# Altium schematic sheet iMX 8M PLUS.SchDoc: i.MX 8M - BLOCK DIAGRAM
size A3; DrawnBy: ELIO F.; Engineer: ELIO F.; Revision: A; SheetNumber: 3; SheetTotal: 16
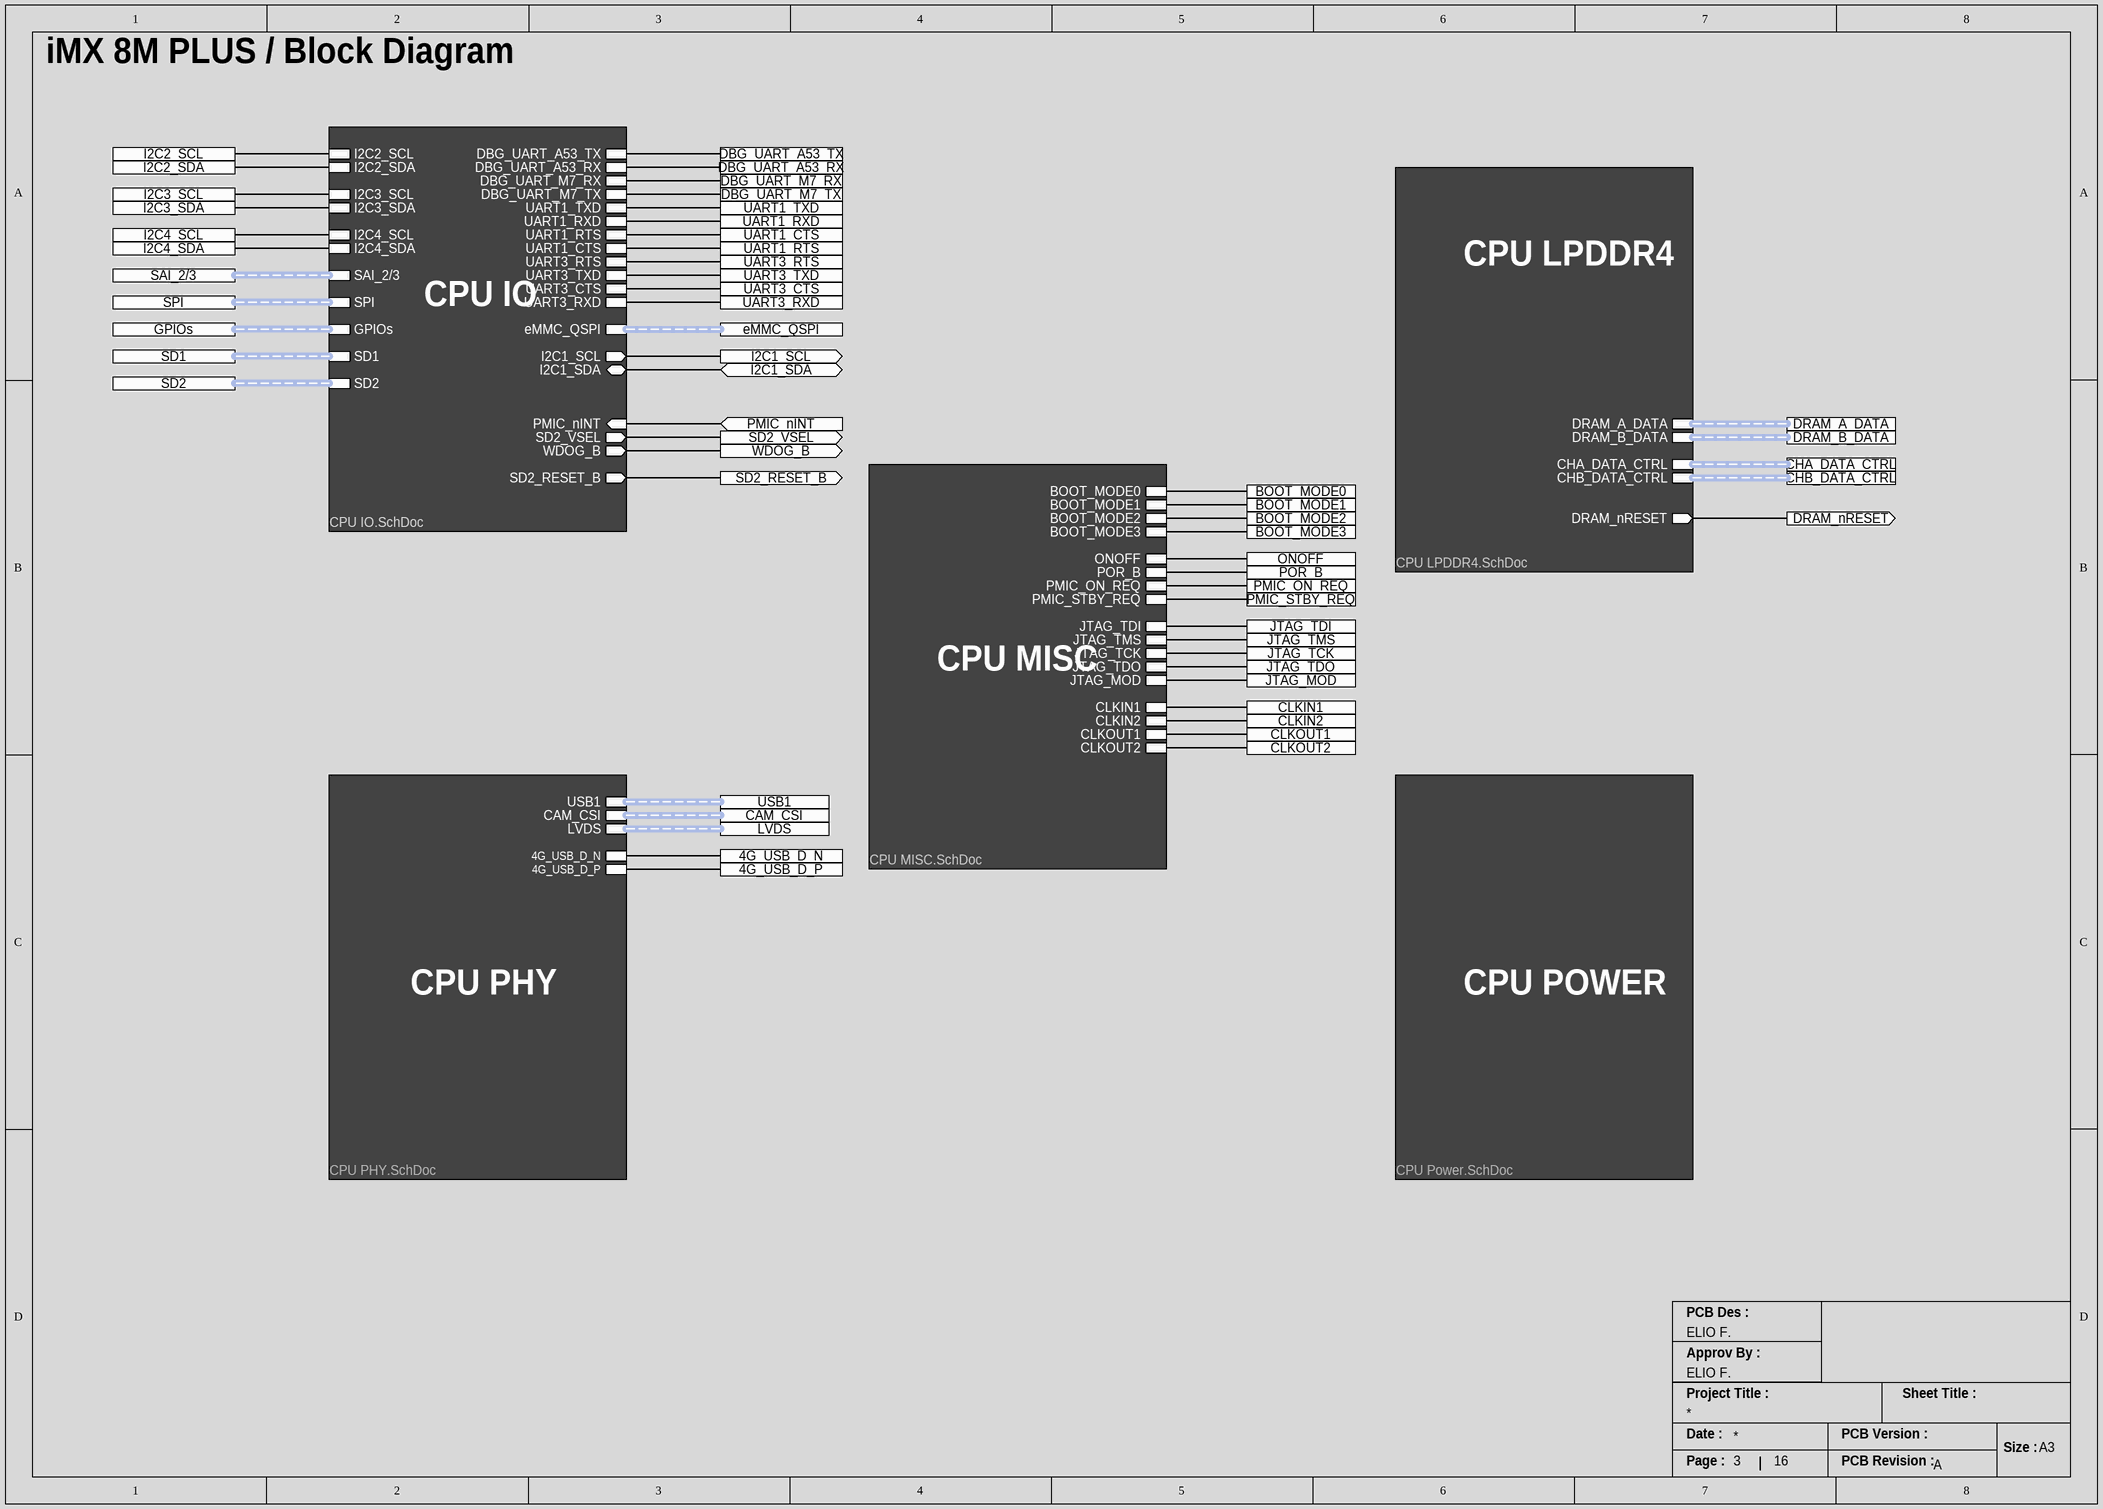
[diagram p0: iMX 8M PLUS.SchDoc]

## Sub-sheets
H = CPU IO.SchDoc: DBG_UART_A53_TX, DBG_UART_A53_RX, DBG_UART_M7_RX, DBG_UART_M7_TX, eMMC_QSPI (harness NAND), I2C1_SCL (out), I2C1_SDA (bidir), PMIC_nINT (in), SD2_VSEL (out), WDOG_B (out), SD2_RESET_B (out), UART1_TXD, UART1_RXD, UART1_RTS, UART1_CTS, I2C2_SCL, I2C2_SDA, I2C3_SCL, I2C3_SDA, I2C4_SCL, I2C4_SDA, UART3_RTS, UART3_TXD, UART3_CTS, UART3_RXD, GPIOs (harness GPIOs), SPI (harness SPI), SAI_2/3 (harness SAI2), SD1 (harness SD1), SD2 (harness SD2)
I = CPU LPDDR4.SchDoc: DRAM_nRESET (out), DRAM_A_DATA (harness DRAM_A_DATA), CHA_DATA_CTRL (harness CHA_DATA_CTRL), DRAM_B_DATA (harness DRAM_B_DATA), CHB_DATA_CTRL (harness CHB_DATA_CTRL)
J = CPU MISC.SchDoc: BOOT_MODE0, BOOT_MODE1, ONOFF, POR_B, PMIC_ON_REQ, PMIC_STBY_REQ, CLKIN1, CLKIN2, CLKOUT1, CLKOUT2, BOOT_MODE2, BOOT_MODE3, JTAG_TDI, JTAG_TMS, JTAG_TCK, JTAG_TDO, JTAG_MOD
K = CPU PHY.SchDoc: USB1 (harness USB), CAM_CSI (harness CAM_CSI), LVDS (harness LVDS), 4G_USB_D_N, 4G_USB_D_P
L = CPU Power.SchDoc: no entries

## Ports
4G_USB_D_N, 4G_USB_D_P, BOOT_MODE0, BOOT_MODE1, BOOT_MODE2, BOOT_MODE3, CAM_CSI (harness DRAM_A), CHA_DATA_CTRL (harness DRAM_A), CHB_DATA_CTRL (harness DRAM_A), CLKIN1, CLKIN2, CLKOUT1, CLKOUT2, DBG_UART_A53_RX, DBG_UART_A53_TX, DBG_UART_M7_RX, DBG_UART_M7_TX, DRAM_A_DATA (harness DRAM_A), DRAM_B_DATA (harness DRAM_A), DRAM_nRESET (out), eMMC_QSPI (harness DRAM_A), GPIOs (harness DRAM_A), I2C1_SCL (out), I2C1_SDA (bidir), I2C2_SCL, I2C2_SDA, I2C3_SCL, I2C3_SDA, I2C4_SCL, I2C4_SDA, JTAG_MOD, JTAG_TCK, JTAG_TDI, JTAG_TDO, JTAG_TMS, LVDS (harness DRAM_A), ONOFF, PMIC_nINT (in), PMIC_ON_REQ, PMIC_STBY_REQ, POR_B, SAI_2/3 (harness DRAM_A), SD1 (harness DRAM_A), SD2 (harness DRAM_A), SD2_RESET_B (out), SD2_VSEL (out), SPI (harness DRAM_A), UART1_CTS, UART1_RTS, UART1_RXD, UART1_TXD, UART3_CTS, UART3_RTS, UART3_RXD, UART3_TXD, USB1 (harness DRAM_A), WDOG_B (out)

## Nets
4G_USB_D_N: port 4G_USB_D_N, sheet K/4G_USB_D_N
4G_USB_D_P: port 4G_USB_D_P, sheet K/4G_USB_D_P
BOOT_MODE0: port BOOT_MODE0, sheet J/BOOT_MODE0
BOOT_MODE1: port BOOT_MODE1, sheet J/BOOT_MODE1
BOOT_MODE2: port BOOT_MODE2, sheet J/BOOT_MODE2
BOOT_MODE3: port BOOT_MODE3, sheet J/BOOT_MODE3
CLKIN1: port CLKIN1, sheet J/CLKIN1
CLKIN2: port CLKIN2, sheet J/CLKIN2
CLKOUT1: port CLKOUT1, sheet J/CLKOUT1
CLKOUT2: port CLKOUT2, sheet J/CLKOUT2
DBG_UART_A53_RX: port DBG_UART_A53_RX, sheet H/DBG_UART_A53_RX
DBG_UART_A53_TX: port DBG_UART_A53_TX, sheet H/DBG_UART_A53_TX
DBG_UART_M7_RX: port DBG_UART_M7_RX, sheet H/DBG_UART_M7_RX
DBG_UART_M7_TX: port DBG_UART_M7_TX, sheet H/DBG_UART_M7_TX
DRAM_nRESET: port DRAM_nRESET, sheet I/DRAM_nRESET
I2C1_SCL: port I2C1_SCL, sheet H/I2C1_SCL
I2C1_SDA: port I2C1_SDA, sheet H/I2C1_SDA
I2C2_SCL: port I2C2_SCL, sheet H/I2C2_SCL
I2C2_SDA: port I2C2_SDA, sheet H/I2C2_SDA
I2C3_SCL: port I2C3_SCL, sheet H/I2C3_SCL
I2C3_SDA: port I2C3_SDA, sheet H/I2C3_SDA
I2C4_SCL: port I2C4_SCL, sheet H/I2C4_SCL
I2C4_SDA: port I2C4_SDA, sheet H/I2C4_SDA
JTAG_MOD: port JTAG_MOD, sheet J/JTAG_MOD
JTAG_TCK: port JTAG_TCK, sheet J/JTAG_TCK
JTAG_TDI: port JTAG_TDI, sheet J/JTAG_TDI
JTAG_TDO: port JTAG_TDO, sheet J/JTAG_TDO
JTAG_TMS: port JTAG_TMS, sheet J/JTAG_TMS
ONOFF: port ONOFF, sheet J/ONOFF
PMIC_nINT: port PMIC_nINT, sheet H/PMIC_nINT
PMIC_ON_REQ: port PMIC_ON_REQ, sheet J/PMIC_ON_REQ
PMIC_STBY_REQ: port PMIC_STBY_REQ, sheet J/PMIC_STBY_REQ
POR_B: port POR_B, sheet J/POR_B
SD2_RESET_B: port SD2_RESET_B, sheet H/SD2_RESET_B
SD2_VSEL: port SD2_VSEL, sheet H/SD2_VSEL
UART1_CTS: port UART1_CTS, sheet H/UART1_RTS
UART1_RTS: port UART1_RTS, sheet H/UART1_CTS
UART1_RXD: port UART1_RXD, sheet H/UART1_RXD
UART1_TXD: port UART1_TXD, sheet H/UART1_TXD
UART3_CTS: port UART3_CTS, sheet H/UART3_CTS
UART3_RTS: port UART3_RTS, sheet H/UART3_RTS
UART3_RXD: port UART3_RXD, sheet H/UART3_RXD
UART3_TXD: port UART3_TXD, sheet H/UART3_TXD
WDOG_B: port WDOG_B, sheet H/WDOG_B

## Buses and harness runs
harness port CAM_CSI = sheet K/CAM_CSI
harness port CHA_DATA_CTRL = sheet I/CHA_DATA_CTRL
harness port CHB_DATA_CTRL = sheet I/CHB_DATA_CTRL
harness port DRAM_A_DATA = sheet I/DRAM_A_DATA
harness port DRAM_B_DATA = sheet I/DRAM_B_DATA
harness port eMMC_QSPI = sheet H/eMMC_QSPI
harness port GPIOs = sheet H/GPIOs
harness port LVDS = sheet K/LVDS
harness port SAI_2/3 = sheet H/SAI_2/3
harness port SD1 = sheet H/SD1
harness port SD2 = sheet H/SD2
harness port SPI = sheet H/SPI
harness port USB1 = sheet K/USB1

## Notes on the sheet
- iMX 8M PLUS / Block Diagram
- CPU IO
- CPU LPDDR4
- CPU MISC
- CPU PHY
- CPU POWER
- PCB Des :
- Approv By :
- Project Title :
- Sheet Title :
- Date :
- PCB Version :
- Size :
- A3
- Page :
- PCB Revision :